# EAGLE design Motor_Slave_2 (EAGLE 9.5.2)
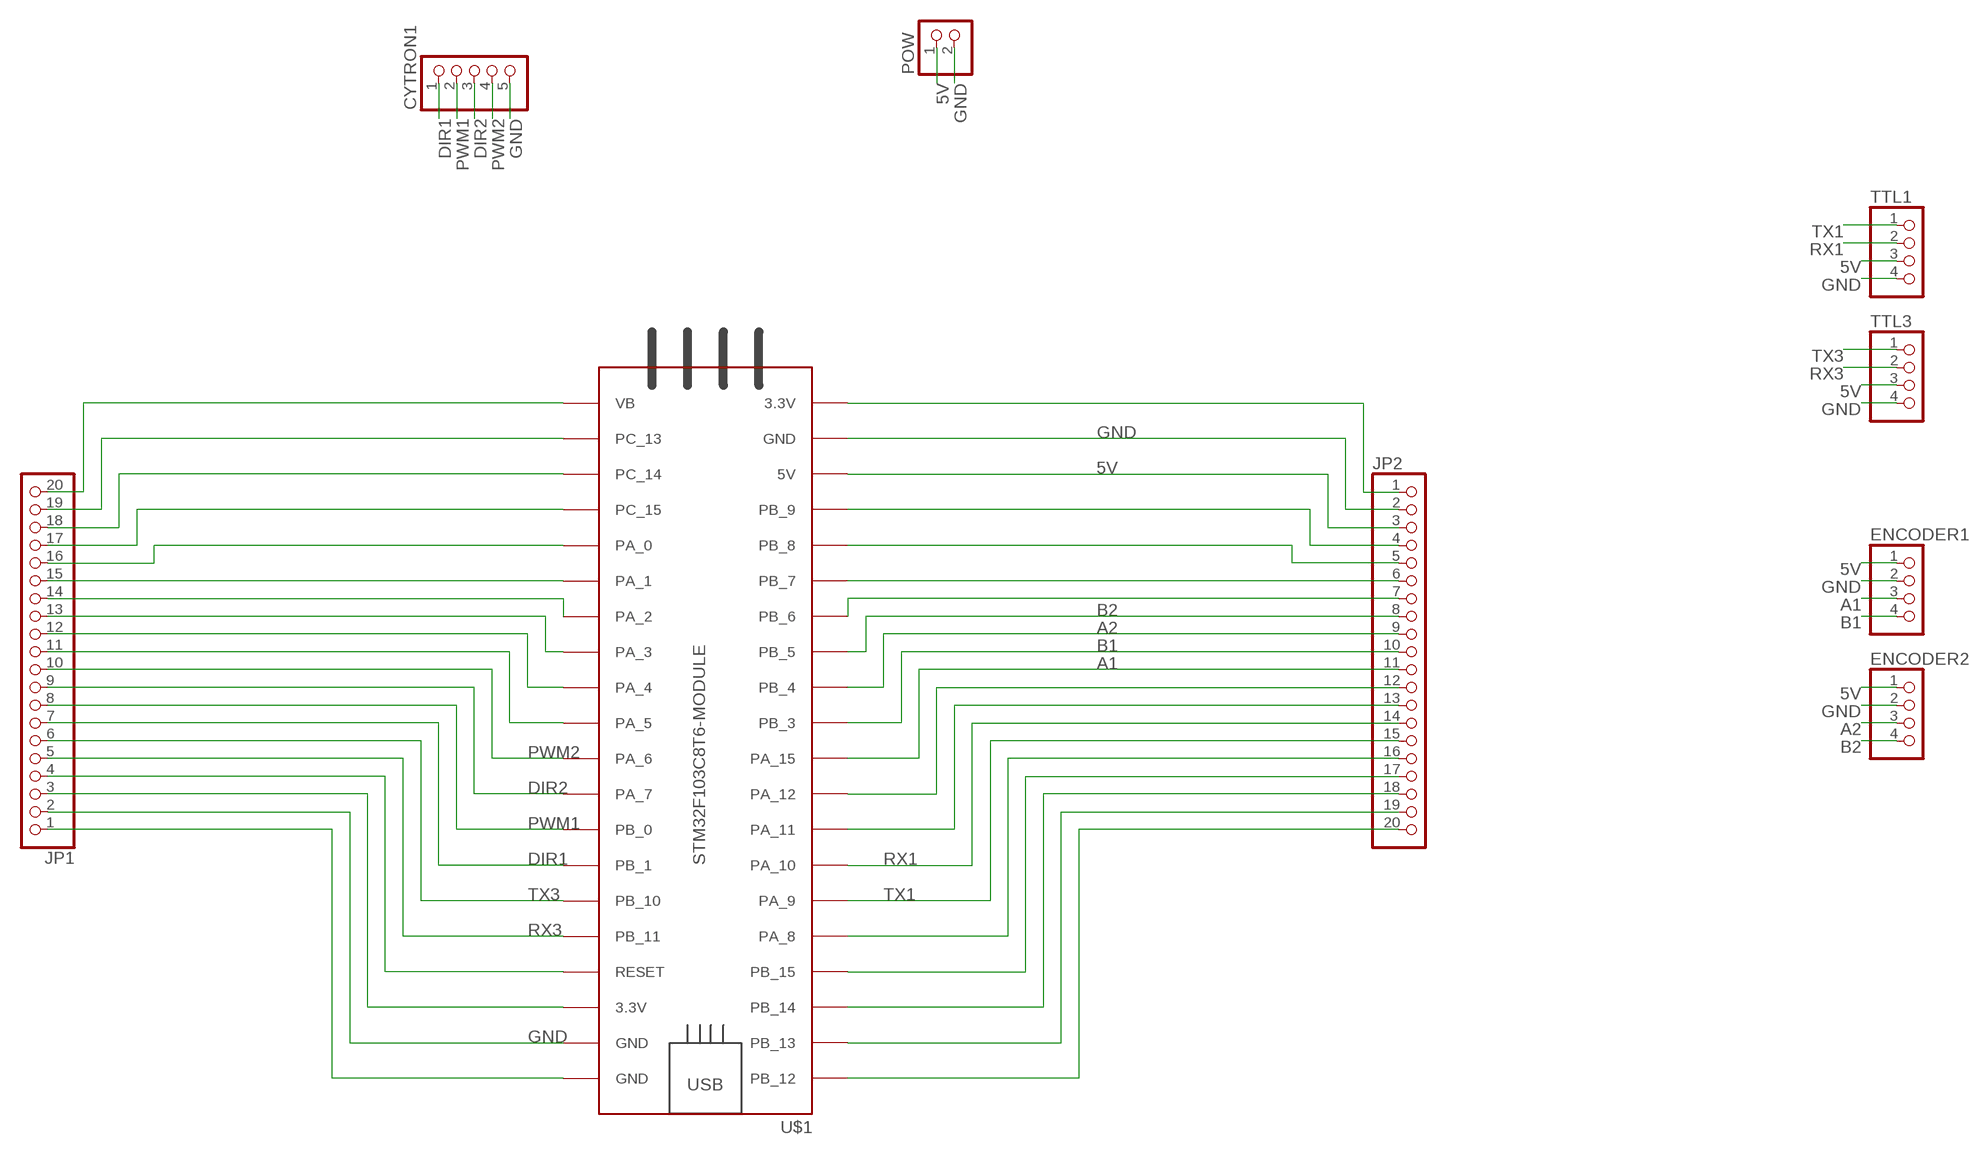
[diagram p0: schematic, sheet 1]

## Parts
CYTRON1  PINHD-5_DATA  [1X05_DATA]
ENCODER1  PINHD-4_DATA  [1X04_DATA]
ENCODER2  PINHD-4_DATA  [1X04_DATA]
JP1  PINHD-1X20  [1X20]
JP2  PINHD-1X20  [1X20]
POW  PINHD-2_DATA  [1X02_DATA]
TTL1  PINHD-4_DATA  [1X04_DATA]
TTL3  PINHD-4_DATA  [1X04_DATA]
U$1  STM32F103C8T6-MODULE  [STM32F103C8T6-MODULE]

## Nets
5V: ENCODER1.1 ENCODER2.1 JP2.3 POW.1 TTL1.3 TTL3.3 U$1.5V
A1: ENCODER1.3 JP2.11 U$1.PA_15
A2: ENCODER2.3 JP2.9 U$1.PB_4
A3: JP2.7 U$1.PB_6
A4: JP2.5 U$1.PB_8
B1: ENCODER1.4 JP2.10 U$1.PB_3
B2: ENCODER2.4 JP2.8 U$1.PB_5
B3: JP2.6 U$1.PB_7
B4: JP2.4 U$1.PB_9
DIR1: CYTRON1.1 JP1.7 U$1.PB_1
DIR2: CYTRON1.3 JP1.9 U$1.PA_7
DIR3: JP1.13 U$1.PA_3
DIR4: JP1.15 U$1.PA_1
GND: CYTRON1.5 ENCODER1.2 ENCODER2.2 JP1.2 JP2.2 POW.2 TTL1.4 TTL3.4 U$1.GND_1(GND) U$1.GND_2(GND)
N$1: JP1.20 U$1.VB
N$2: JP1.19 U$1.PC_13
N$3: JP1.18 U$1.PC_14
N$5: JP1.17 U$1.PC_15
N$9: JP1.12 U$1.PA_4
N$10: JP1.11 U$1.PA_5
N$17: JP1.4 U$1.RESET
N$18: JP1.3 U$1.3.3V_2(3.3V)
N$20: JP1.1 U$1.GND_3(GND)
N$21: JP2.1 U$1.3.3V_1(3.3V)
N$32: JP2.12 U$1.PA_12
N$33: JP2.13 U$1.PA_11
N$36: JP2.16 U$1.PA_8
N$37: JP2.17 U$1.PB_15
N$38: JP2.18 U$1.PB_14
N$39: JP2.19 U$1.PB_13
N$40: JP2.20 U$1.PB_12
PWM1: CYTRON1.2 JP1.8 U$1.PB_0
PWM2: CYTRON1.4 JP1.10 U$1.PA_6
PWM3: JP1.14 U$1.PA_2
PWM4: JP1.16 U$1.PA_0
RX1: JP2.14 TTL1.2 U$1.PA_10
RX3: JP1.5 TTL3.2 U$1.PB_11
TX1: JP2.15 TTL1.1 U$1.PA_9
TX3: JP1.6 TTL3.1 U$1.PB_10

## Library data of the parts
CYTRON1 = MIA_LIBRARY-2-2-2:PINHD-5_DATA: PIN HEADER
ENCODER1 ENCODER2 TTL1 TTL3 = MIA_LIBRARY-2-2-2:PINHD-4_DATA: PIN HEADER
JP1 JP2 = MIA_LIBRARY-2-2-2:PINHD-1X20: PIN HEADER
POW = MIA_LIBRARY-2-2-2:PINHD-2_DATA: PIN HEADER
U$1 = MIA_LIBRARY-2-2-2:STM32F103C8T6-MODULE: STM32F103C8T6 module with ARM Cortex-3, 20kB SRAM, 64kB Flash, 72MHz

## Board
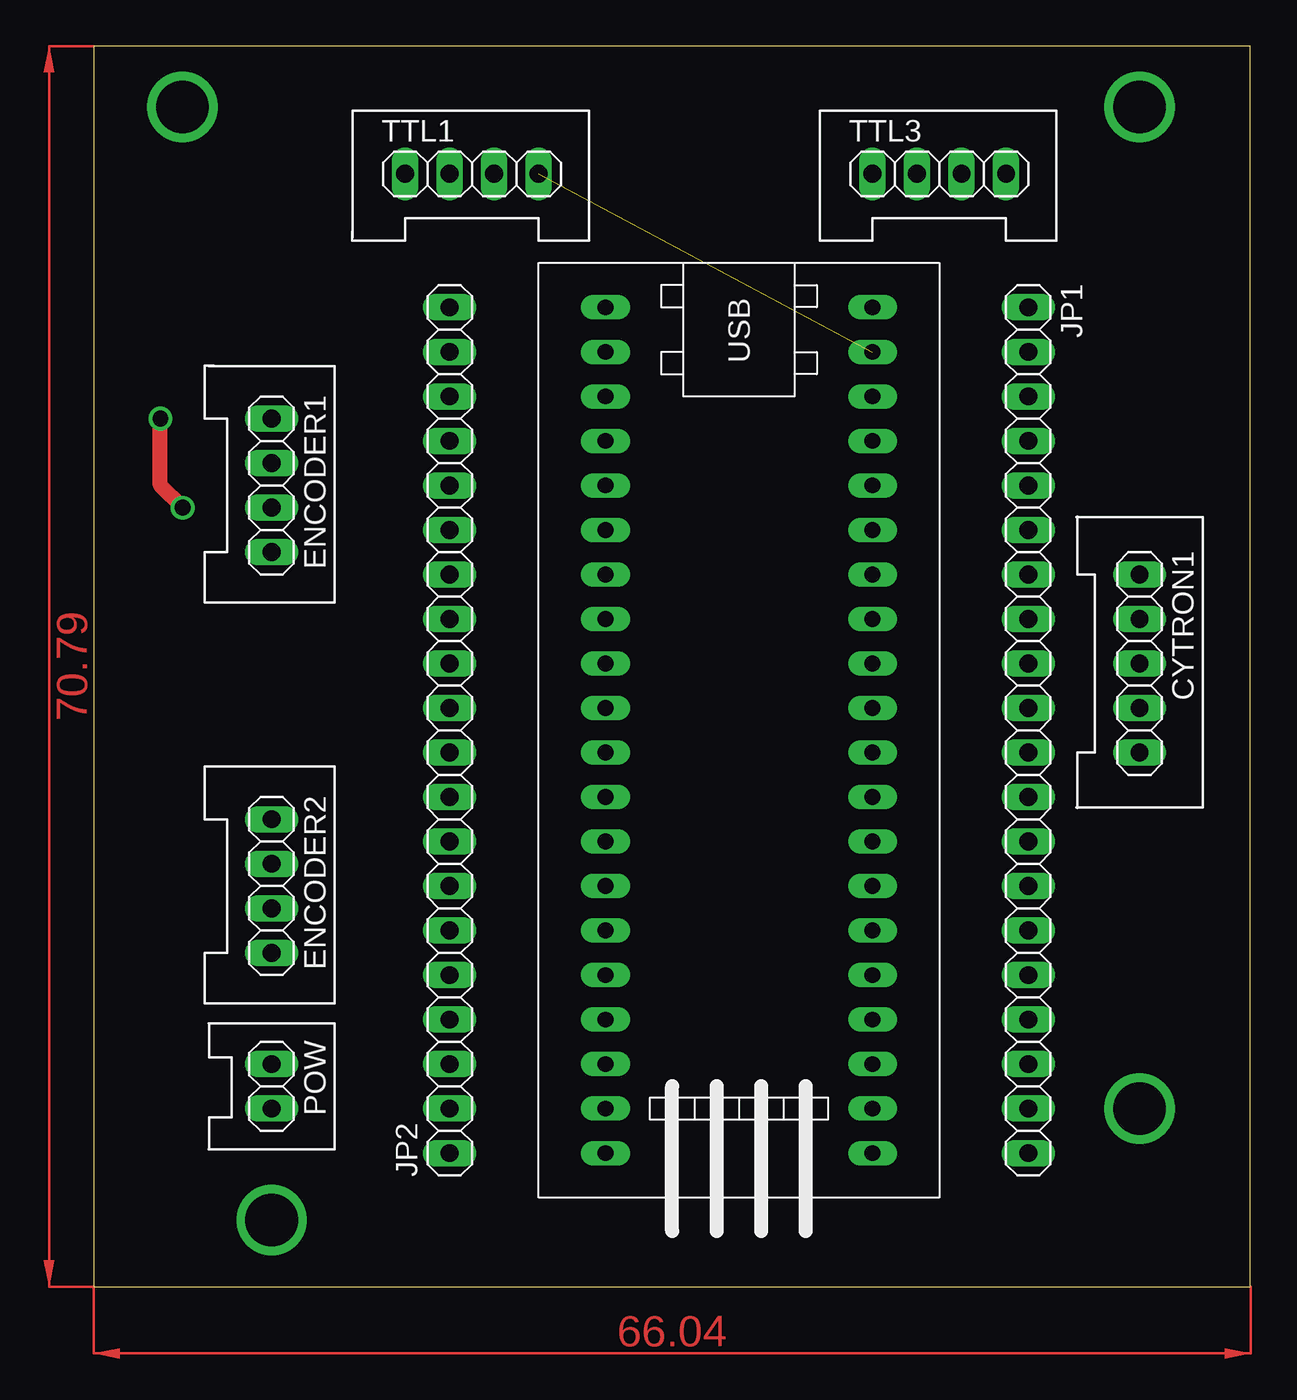
[diagram p1: board, top side]
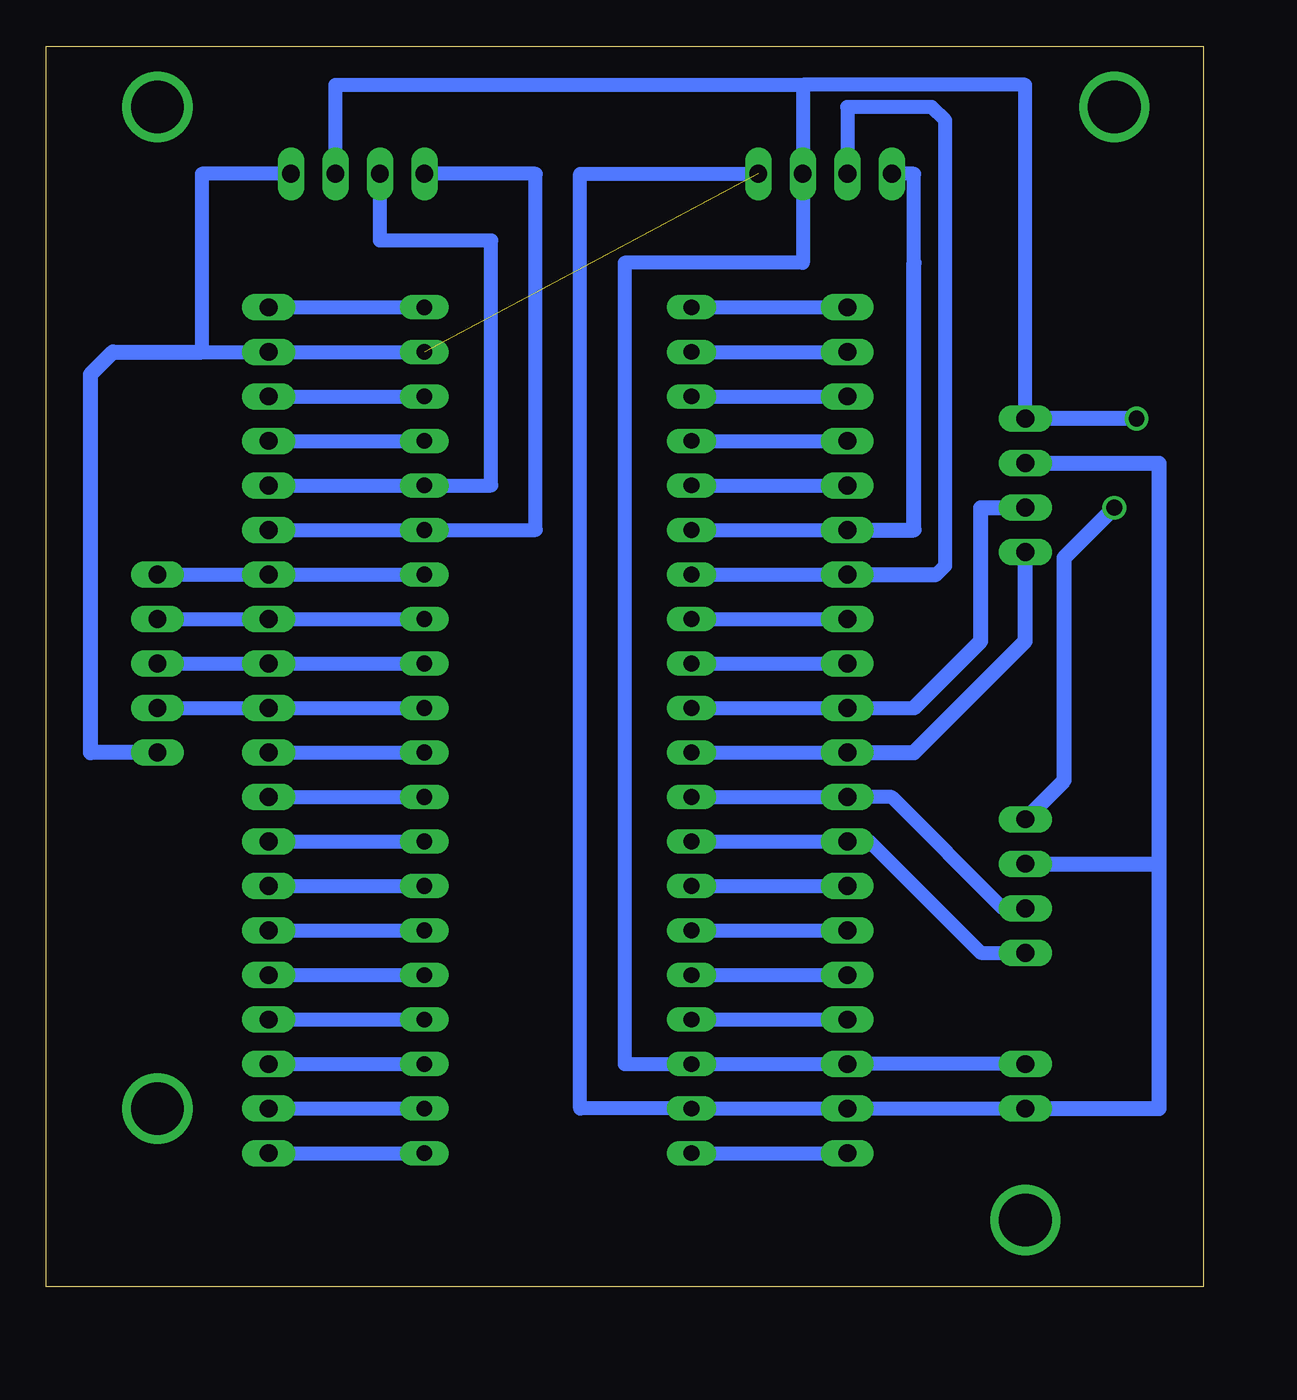
[diagram p2: board, bottom side, seen from below]

Size 66.02 x 70.79 mm. Coordinates in mm from the lower left corner, seen from the top.
Outline: 0,0 66.02,0 66.02,70.79 0,70.79 0,0
Copper layers (1*16): Top 0.035mm / dielectric 1.5mm / Bottom 0.035mm
Design rules "default": minimum track width 6mil, minimum drill 0.35mm, track to track 6mil, track to pad 6mil, pad to pad 6mil, via to via 6mil, smd to smd 6mil, copper to edge 40mil, drill to drill 6mil, minimum pad ring 10mil, minimum via ring 8mil, stop-mask expansion 4mil, vias tented up to drill 0mil, thermal gap 10mil

### Footprints (pad centres in the part's own frame; a part is rotated, then mirrored left to right if it is on the bottom)
1X05_DATA = drill 1.016 long: 1 -5.08,0; 2 -2.54,0; 3 0,0; 4 2.54,0; 5 5.08,0
1X04_DATA = drill 1.016 long: 1 -3.81,0; 2 -1.27,0; 3 1.27,0; 4 3.81,0
1X20 = drill 1.016 long: 1 -24.13,0; 2 -21.59,0; 3 -19.05,0; 4 -16.51,0; 5 -13.97,0; 6 -11.43,0; 7 -8.89,0; 8 -6.35,0; 9 -3.81,0; 10 -1.27,0; 11 1.27,0; 12 3.81,0; 13 6.35,0; 14 8.89,0; 15 11.43,0; 16 13.97,0; 17 16.51,0; 18 19.05,0; 19 21.59,0; 20 24.13,0
1X02_DATA = drill 1.016 long: 1 -1.27,0; 2 1.27,0
STM32F103C8T6-MODULE = drill 0.9 long: 3.3V_1 25.4,-7.62; 3.3V_2 -17.78,7.62; 5V 20.32,-7.62; GND_1 22.86,-7.62; GND_2 -20.32,7.62; GND_3 -22.86,7.62; PA_0 15.24,7.62; PA_1 12.7,7.62; PA_2 10.16,7.62; PA_3 7.62,7.62; PA_4 5.08,7.62; PA_5 2.54,7.62; PA_6 0,7.62; PA_7 -2.54,7.62; PA_8 -12.7,-7.62; PA_9 -10.16,-7.62; PA_10 -7.62,-7.62; PA_11 -5.08,-7.62; PA_12 -2.54,-7.62; PA_15 0,-7.62; PB_0 -5.08,7.62; PB_1 -7.62,7.62; PB_3 2.54,-7.62; PB_4 5.08,-7.62; PB_5 7.62,-7.62; PB_6 10.16,-7.62; PB_7 12.7,-7.62; PB_8 15.24,-7.62; PB_9 17.78,-7.62; PB_10 -10.16,7.62; PB_11 -12.7,7.62; PB_12 -22.86,-7.62; PB_13 -20.32,-7.62; PB_14 -17.78,-7.62; PB_15 -15.24,-7.62; PC_13 22.86,7.62; PC_14 20.32,7.62; PC_15 17.78,7.62; RESET -15.24,7.62; VB 25.4,7.62

### Placement (x,y rotation side)
CYTRON1  59.69,35.56 270 top
ENCODER1  10.16,45.72 270 top
ENCODER2  10.16,22.86 270 top
JP1  53.34,31.75 270 top
JP2  20.32,31.75 90 top
POW  10.16,11.43 270 top
TTL1  21.59,63.5 0 top
TTL3  48.26,63.5 0 top
U$1  36.83,33.02 270 top

### Tracks (layer width: path | path; a pad name or v marks a point on that pad's centre or on a via)
5V  (via drill 0.9)
  Top 0.85: v5.08,44.45 3.81,45.72 v3.81,49.53
  Bottom 0.813: TTL3.3 49.53,68.58 22.86,68.58 | 22.86,68.58 TTL1.3 22.86,58.42 33.02,58.42 33.02,12.7 U$1.5V JP2.3 POW.1 | ENCODER1.1 10.16,68.58 22.86,68.58
  Bottom 0.85: ENCODER2.1 7.94,28.89 7.94,41.59 v5.08,44.45 | v3.81,49.53 ENCODER1.1
A1
  Bottom 0.813: U$1.PA_15 JP2.11 16.51,33.02
  Bottom 0.85: 16.51,33.02 12.7,36.83 12.7,44.45 ENCODER1.3
A2
  Bottom 0.813: U$1.PB_4 JP2.9 17.78,27.94 11.43,21.59 ENCODER2.3
A3
  Bottom 0.813: U$1.PB_6 JP2.7
A4
  Bottom 0.813: U$1.PB_8 JP2.5
B1
  Bottom 0.813: U$1.PB_3 JP2.10
  Bottom 0.85: JP2.10 16.51,30.48 10.16,36.83 ENCODER1.4
B2
  Bottom 0.813: U$1.PB_5 JP2.8 19.05,25.4 12.7,19.05 ENCODER2.4
B3
  Bottom 0.813: U$1.PB_7 JP2.6
B4
  Bottom 0.813: U$1.PB_9 JP2.4
DIR1
  Bottom 0.813: U$1.PB_1 JP1.7 CYTRON1.1
DIR2
  Bottom 0.813: U$1.PA_7 JP1.9 CYTRON1.3
DIR3
  Bottom 0.813: JP1.13 U$1.PA_3
DIR4
  Bottom 0.813: JP1.15 U$1.PA_1
GND  (1 unrouted)
  Bottom 0.813: U$1.GND_2 JP1.2 57.15,53.34 57.15,63.5 TTL3.4 | TTL1.4 35.56,63.5 35.56,10.16 U$1.GND_1 JP2.2 POW.2
  Bottom 0.85: POW.2 2.54,10.16 2.54,24.13 | CYTRON1.5 63.5,30.48 63.5,52.07 62.23,53.34 57.15,53.34 | ENCODER2.2 2.54,24.13 | ENCODER1.2 2.54,46.99 2.54,24.13
N$1
  Bottom 0.813: JP1.20 U$1.VB
N$2
  Bottom 0.813: JP1.19 U$1.PC_13
N$3
  Bottom 0.813: JP1.18 U$1.PC_14
N$4  (via drill 3)
  other vias: 10.16,3.81
N$5
  Bottom 0.813: JP1.17 U$1.PC_15
N$6  (via drill 3)
  other vias: 59.69,67.31
N$7  (via drill 3)
  other vias: 59.69,10.16
N$8  (via drill 3)
  other vias: 5.08,67.31
N$9
  Bottom 0.813: JP1.12 U$1.PA_4
N$10
  Bottom 0.813: JP1.11 U$1.PA_5
N$17
  Bottom 0.813: JP1.4 U$1.RESET
N$18
  Bottom 0.813: JP1.3 U$1.3.3V_2
N$20
  Bottom 0.813: JP1.1 U$1.GND_3
N$21
  Bottom 0.813: U$1.3.3V_1 JP2.1
N$32
  Bottom 0.813: U$1.PA_12 JP2.12
N$33
  Bottom 0.813: U$1.PA_11 JP2.13
N$36
  Bottom 0.813: U$1.PA_8 JP2.16
N$37
  Bottom 0.813: U$1.PB_15 JP2.17
N$38
  Bottom 0.813: U$1.PB_14 JP2.18
N$39
  Bottom 0.813: U$1.PB_13 JP2.19
N$40
  Bottom 0.813: U$1.PB_12 JP2.20
PWM1
  Bottom 0.813: U$1.PB_0 JP1.8 CYTRON1.2
PWM2
  Bottom 0.813: U$1.PA_6 JP1.10 CYTRON1.4
PWM3
  Bottom 0.813: JP1.14 U$1.PA_2
PWM4
  Bottom 0.813: JP1.16 U$1.PA_0
RX1
  Bottom 0.813: U$1.PA_10 21.59,40.64 JP2.14 | 15.24,40.64 14.73,41.15 14.73,66.55 15.49,67.31 20.32,67.31 TTL1.2
  Bottom 0.85: 21.59,40.64 15.24,40.64
RX3
  Bottom 0.813: JP1.5 U$1.PB_11 40.64,45.72 40.64,59.69 46.99,59.69 TTL3.2
TX1
  Bottom 0.813: U$1.PA_9 JP2.15 | 16.51,58.42 16.51,63.5 TTL1.1
  Bottom 0.85: JP2.15 16.51,43.18 16.51,58.42
TX3
  Bottom 0.813: JP1.6 U$1.PB_10 38.1,43.18 38.1,63.5 TTL3.1
(copper drawn outside any net)
  shapes: Top area x2